# Altium schematic sheet Intdiff.SchDoc
size A; SheetNumber: 5; SheetTotal: 5
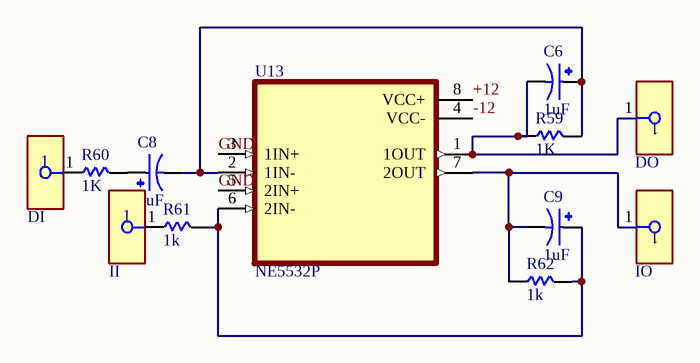
[diagram p0: Intdiff.SchDoc]

## Parts
C6  1uF  [CAPPRD250W50D630H1250]
C8  1uF  [CAPPRD250W50D630H1250]
C9  1uF  [CAPPRD250W50D630H1250]
DI  1581-5  [FP-1581-5-MFG]  (value not drawn)
DO  1581-5  [FP-1581-5-MFG]  (value not drawn)
II  1581-5  [FP-1581-5-MFG]  (value not drawn)
IO  1581-5  [FP-1581-5-MFG]  (value not drawn)
R59  value 1K  [RESAD1100W55L680D260]  (hidden comment: MFR-25FBF52-1K)
R60  value 1K  [RESAD1100W55L680D260]  (hidden comment: MFR-25FBF52-1K)
R61  value 1k  [RESAD1100W55L680D260]  (hidden comment: MFR-25FBF52-1K)
R62  value 1k  [RESAD1100W55L680D260]  (hidden comment: MFR-25FBF52-1K)
U13  NE5532P  [DIP794W45P254L959H508Q8]

## Nets
+12: U13.8(VCC+)
-12: U13.4(VCC-)
GND: U13.3(1IN+) U13.5(2IN+)
NetC6_N: C6.N DO.1 R59.1 U13.1(1OUT)
NetC6_P: C6.P C8.N R59.2 U13.2(1IN-)
NetC8_P: C8.P R60.2
NetC9_N: C9.N IO.1 R62.1 U13.7(2OUT)
NetC9_P: C9.P R61.2 R62.2 U13.6(2IN-)
NetDI_1: DI.1 R60.1
NetII_1: II.1 R61.1

## Library data of the parts
C6 C8 C9 = EEUFS1J681S: CAP ALUM 680UF 20% 63V THRU HOLE; MP: EEU-FS1J681S; MF: Panasonic Electronic Components; Package: RADIAL-2 Panasonic; Availability: In Stock; SnapEDA_Link: https://www.snapeda.com/parts/EEU-FS1J681S/Panasonic/view-part/5562022/?ref=snap; Price: None; Check_prices: https://www.snapeda.com/parts/EEU-FS1J681S/Panasonic/view-part/5562022/?ref=eda; Value: *
DI DO II IO = CMP-73906-000011-1: CONN BANANA JACK TURRET GREEN; Body Material: PC; Number of Contacts: 1; Max Current Rating: 15A; Voltage Rating (AC): 30V; Insulation: Mating End Insulated; Voltage Rating: 2.5kV; Voltage Rating (DC): 60V; Gender: Female; Height: 0.25inch; Mount: Panel; RoHS Compliant: Yes; Length: 1.22inch; Orientation: Straight; Diameter: 4.22mm; Lead Free: Lead Free; Package Quantity: 1; Termination: Turret; Current Rating: 15A; Packaging: Bag; Series: 1581; REACH SVHC: No SVHC; Number of Positions: 1; Contact Plating: Tin; Housing Color: Green; Contact Material: Brass; Insulation Material: Polycarbonate; Weight: 0.126lb; Number of Ports: 1; Color: Green; Housing Material: Polycarbonate; Width: 4inch
R59-R62 = MFR-25FBF52-1K: 1.07 kOhms Â±1% 0.25W, 1/4W Through Hole Resistor Axial - Metal Film; MF: Yageo; SnapEDA_Link: https://www.snapeda.com/parts/MFR-25FBF52-1K/Yageo/view-part/?ref=snap; Package: RADIAL-2 YAGEO; MP: MFR-25FBF52-1K; Check_prices: https://www.snapeda.com/parts/MFR-25FBF52-1K/Yageo/view-part/?ref=eda
U13 = NE5532P: Dual, 30-V, 10-MHz, low-noise operational amplifier for audio applications; MF: Texas Instruments; SnapEDA_Link: https://www.snapeda.com/parts/NE5532P/Texas+Instruments/view-part/?ref=snap; Package: PDIP-8 Texas; Value: *; MP: NE5532P; Check_prices: https://www.snapeda.com/parts/NE5532P/Texas+Instruments/view-part/?ref=eda